# EAGLE design Nixieclock (EAGLE 7.2.0)
CNAME: http://niekproductions.com/; CREVISION: 1.0; DESIGNER: Niek Blankers

## Sheet 1 of 2
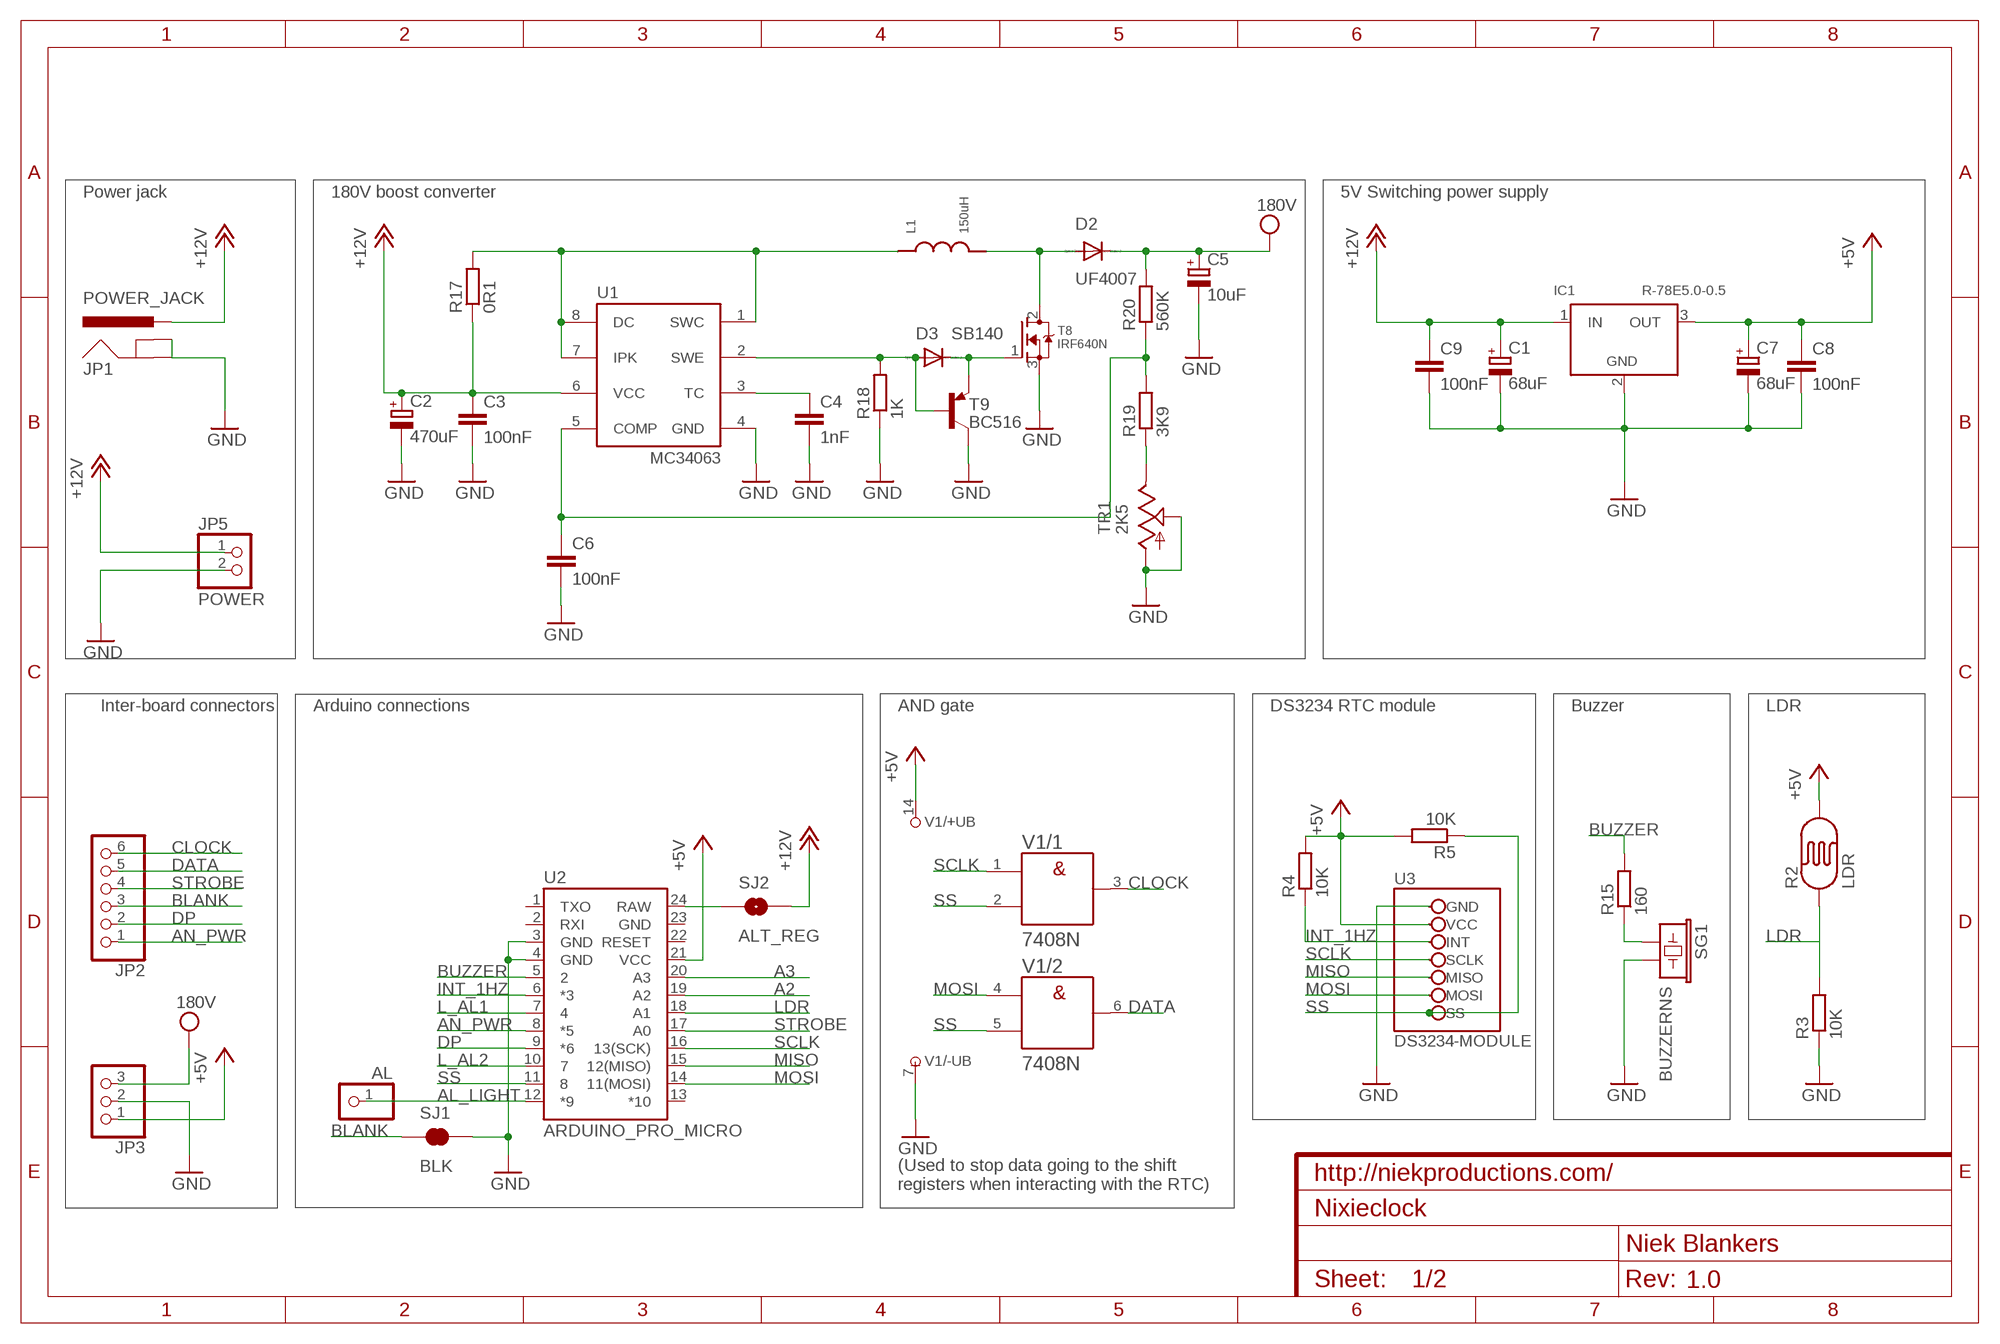
[diagram p0: schematic, sheet 1]

### Parts
AL  PINHD-1X1  [1X01]
C1  68uF  CPOL-EUE2.5-6  [E2,5-6]
C2  470uF  CPOL-EUE5-10.5  [E5-10,5]
C3  100nF  C-EU025-024X044  [C025-024X044]
C4  1nF  C-EU025-024X044  [C025-024X044]
C5  10uF  CPOL-EUE5-10.5  [E5-10,5]
C6  100nF  C-EU025-024X044  [C025-024X044]
C7  68uF  CPOL-EUE2.5-6  [E2,5-6]
C8  100nF  C-EU025-025X050  [C025-025X050]
C9  100nF  C-EU025-025X050  [C025-025X050]
D2  UF4007  1N4933  [DO41-10]
D3  SB140  1N4004  [DO41-10]
IC1  R-78E5.0-0.5  [R-78E]
JP1  POWER_JACK  POWER_JACKPTH_LOCK  [POWER_JACK_PTH_LOCK]
JP2  PINHD-1X6  [1X06]
JP3  PINHD-1X3  [1X03]
JP5  POWER  PINHD-1X2  [1X02]
L1  150uH  INDUCTOR  [INDUCTOR]
R2  LDR  PHOTOCELLPTH  [PHOTOCELL]
R3  10K  R-EU_0204/7  [0204/7]
R4  10K  R-EU_0204/7  [0204/7]
R5  10K  R-EU_0204/7  [0204/7]
R15  160  R-EU_0204/7  [0204/7]
R17  0R1  R-EU_0309/12  [0309/12]
R18  1K  R-EU_0207/10  [0207/10]
R19  3K9  R-EU_0207/10  [0207/10]
R20  560K  R-EU_0207/10  [0207/10]
SG1  BUZZERNS  [BUZZER-12MM-NS]
SJ1  BLK  JUMPER-PAD-2-NC_BY_TRACE  [PAD-JUMPER-2-NC_BY_TRACE_YES_SILK]
SJ2  ALT_REG  SOLDERJUMPERNO  [SJ_2S-NO]
T8  IRF640N  MOSFET-NGDS_TO220V  [TO220V]
T9  BC516  [TO92-EBC]
TR1  2K5  TRIM  [6MM]
U1  MC34063  MC33063/MC34063P  [DIL08]
U2  ARDUINO_PRO_MICRO  [ARDUINO_PRO_MICRO]
U3  DS3234-MODULE  [GEETECH-DS3234]
V1  7408N  [DIL14]

### Nets
+5V: C7.+ C8.1 IC1.3(OUT) JP3.1 R2.2 R4.2 R5.2 U2.21(VCC) U3.VCC V1.14(/+UB:+UB) ; also sheet 2
+12V: C1.+ C2.+ C3.1 C9.1 IC1.1(IN) JP1.PWR JP5.1 R17.1 SJ2.2 U1.6(VCC)
A2: U2.19(A2) ; also sheet 2
A3: U2.20(A3) ; also sheet 2
AL_LIGHT: AL.1 U2.12(*9)
AN_PWR: JP2.1 U2.8(*5) ; also sheet 2
BLANK: JP2.3 SJ1.1
BUZZER: R15.2 U2.5
CLOCK: JP2.6 V1.3(/1:Y)
DATA: JP2.5 V1.6(/2:Y)
DP: JP2.2 U2.9(*6)
GND: C1.- C2.- C3.2 C4.2 C5.- C6.2 C7.- C8.2 C9.2 IC1.2(GND) JP1.GND JP1.GNDBREAK JP3.2 JP5.2 R3.1 R18.1 SG1.- SG1.-- SJ1.2 T8.3(S) T9.C TR1.A TR1.S U1.4(GND) U2.3(GND) U2.4(GND) U3.GND~1(GND) U3.GND~2(GND) V1.7(/-UB:-UB) ; also sheet 2
INT_1HZ: R4.1 U2.6(*3) U3.INT
L_AL1: U2.7 ; also sheet 2
L_AL2: U2.10 ; also sheet 2
LDR: R2.1 R3.2 U2.18(A1)
MISO: U2.15(12(MISO)) U3.MISO
MOSI: U2.14(11(MOSI)) U3.MOSI V1.4(/2:A)
N$5: D3.A R18.2 T9.B U1.2(SWE)
N$6: D3.C T8.1(G) T9.E
N$7: C4.1 U1.3(TC)
N$8: L1.P$1 R17.2 U1.1(SWC) U1.7(IPK) U1.8(DC)
N$9: D2.A L1.P$2 T8.2(D)
N$10: C6.1 R19.2 R20.1 U1.5(COMP)
N$11: R19.1 TR1.E
N$14: SJ2.1 U2.24(RAW)
N$21: R15.1 SG1.+
SCLK: U2.16(13(SCK)) U3.SCLK V1.1(/1:A)
SS: R5.1 U2.11 U3.SS V1.2(/1:B) V1.5(/2:B)
STROBE: JP2.4 U2.17(A0)
VPP: C5.+ D2.C JP3.3 R20.2 ; supply symbol labelled 180V ; also sheet 2
Unconnected: U2.1(TXO) U2.2(RXI) U2.13(*10) U2.22(RESET) U2.23(GND)

### Notes on the sheet
- Power jack | 180V boost converter | 5V Switching power supply
- Inter-board connectors | Arduino connections | AND gate | DS3234 RTC module | Buzzer | LDR
- (Used to stop data going to the shift 
  registers when interacting with the RTC)

## Sheet 2 of 2
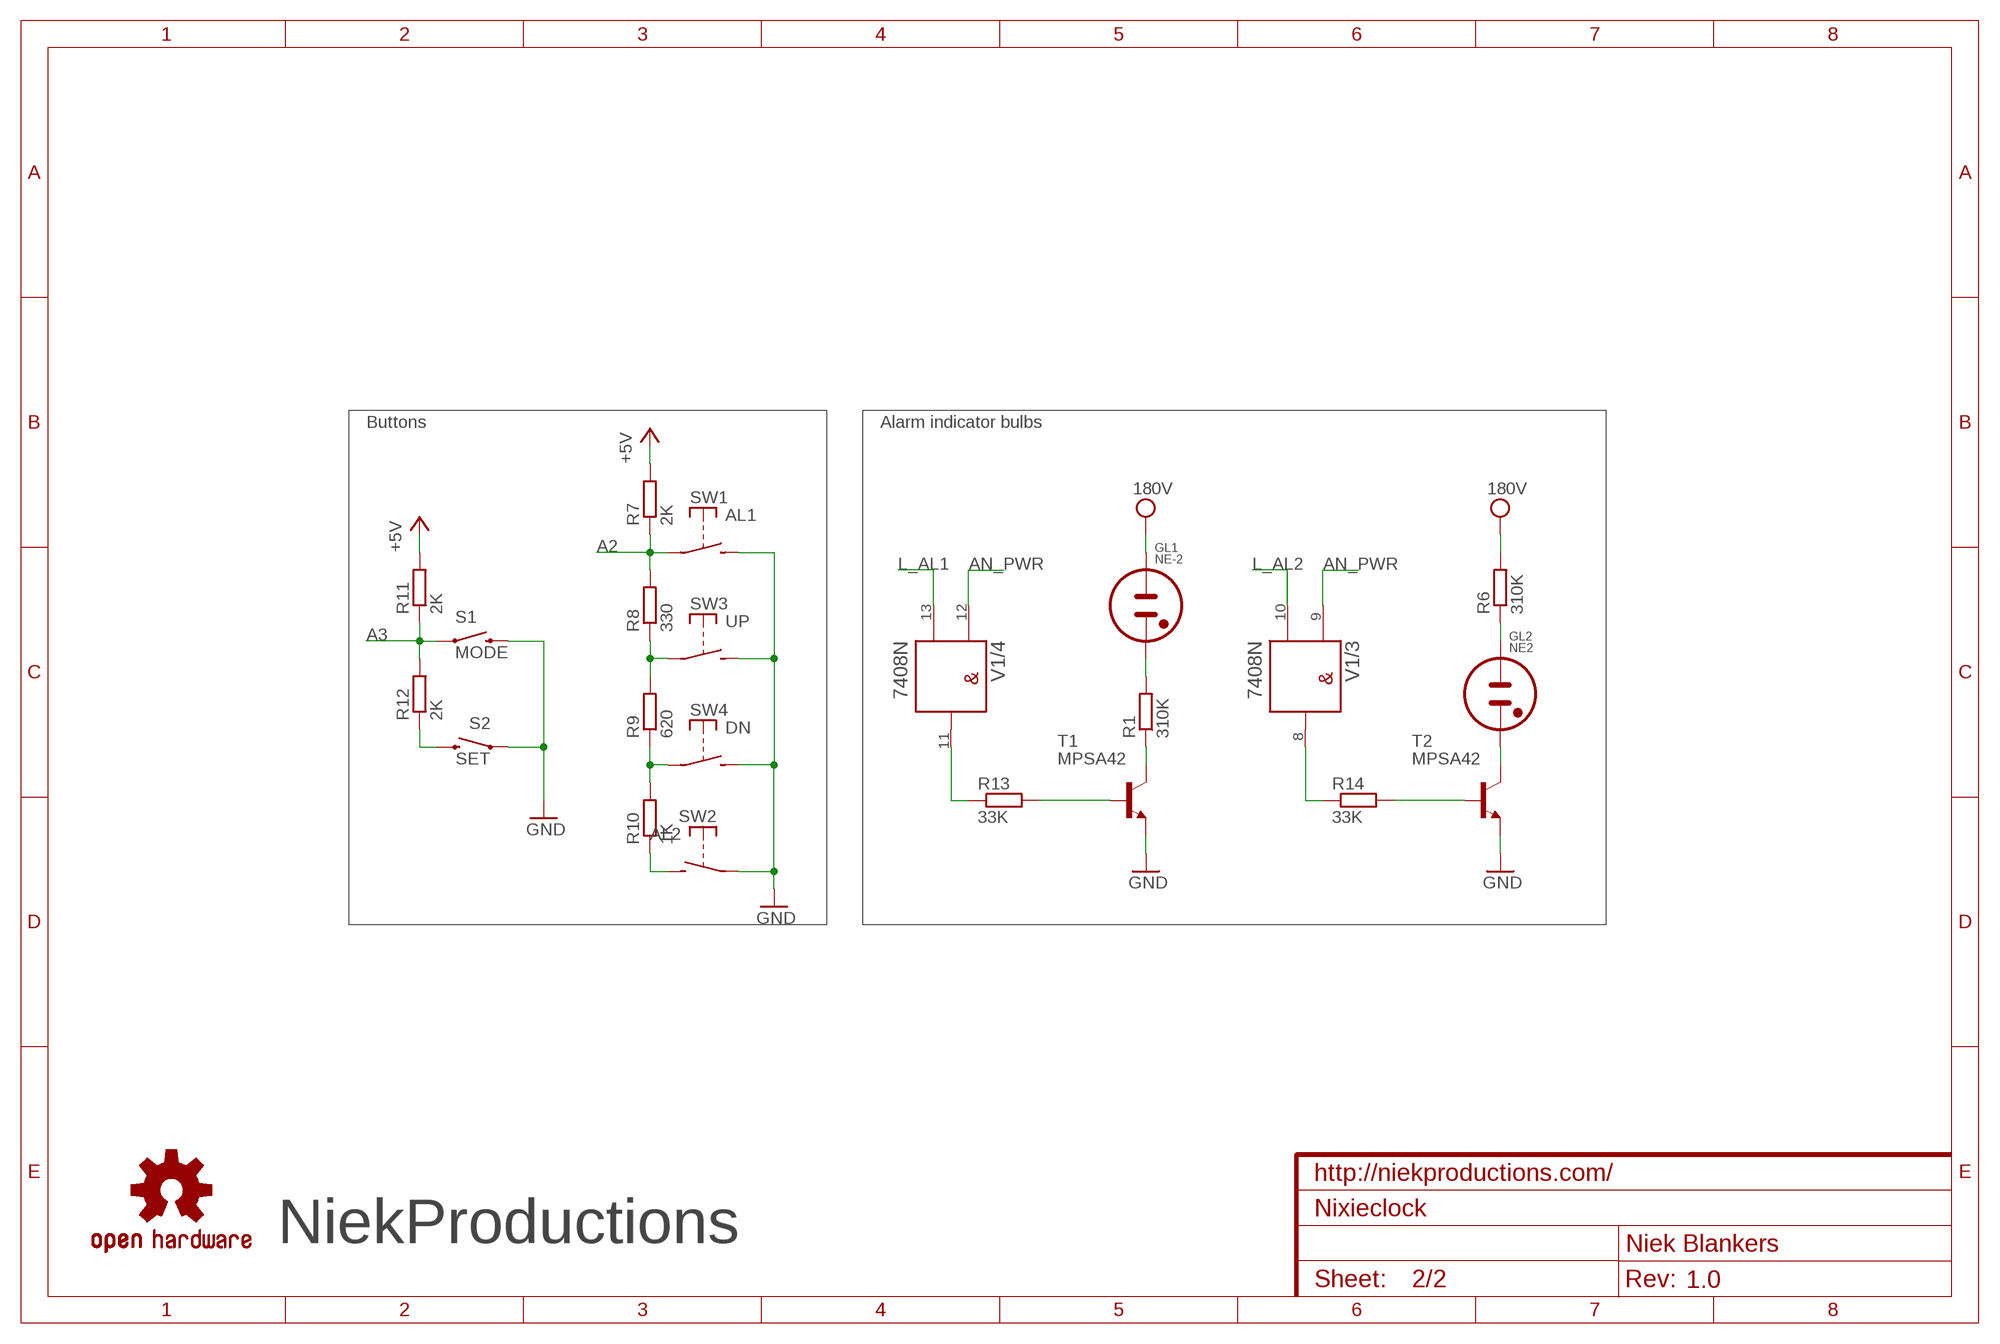
[diagram p1: schematic, sheet 2]

### Parts
GL1  NE-2  NE2-NEON-BULB-DRILL  [NE2-NEON-BULB-DRILL]
GL2  NE2  NE2-NEON-BULB-DRILL  [NE2-NEON-BULB-DRILL]
LOGO2  OSHW-LOGOL  [OSHW-LOGO-L]
R1  310K  R-EU_0204/2V  [0204V]
R6  310K  R-EU_0204/7  [0204/7]
R7  2K  R-EU_0204/7  [0204/7]
R8  330  R-EU_0204/2V  [0204V]
R9  620  R-EU_0204/2V  [0204V]
R10  1K  R-EU_0204/2V  [0204V]
R11  2K  R-EU_0204/7  [0204/7]
R12  2K  R-EU_0204/7  [0204/7]
R13  33K  R-EU_0204/7  [0204/7]
R14  33K  R-EU_0204/7  [0204/7]
S1  MODE  SWITCH-MOMENTARY-2SIDE_EZ  [TACTILE-PTH-SIDEEZ]
S2  SET  SWITCH-MOMENTARY-2SIDE_EZ  [TACTILE-PTH-SIDEEZ]
SW1  AL1  TACTILE-SQ12.65MM-WHITE  [SW-12.65MM-SQ-WHITE]
SW2  AL2  TACTILE-SQ12.65MM-WHITE  [SW-12.65MM-SQ-WHITE]
SW3  UP  TACTILE-SQ12.65MM-WHITE  [SW-12.65MM-SQ-WHITE]
SW4  DN  TACTILE-SQ12.65MM-WHITE  [SW-12.65MM-SQ-WHITE]
T1  MPSA42  MPSA42-NPN-TO92-EBC  [TO92-EBC]
T2  MPSA42  MPSA42-NPN-TO92-EBC  [TO92-EBC]
U$4  NPLOGO1CM-DIA  [NPLOGO-1CM]

### Nets
+5V: R7.2 R11.2 ; also sheet 1
A2: R7.1 R8.2 SW1.SW-CENTER(P) ; also sheet 1
A3: R11.1 R12.2 S1.1 ; also sheet 1
AN_PWR: V1.9(/3:A) V1.12(/4:A) ; also sheet 1
GND: S1.2 S2.1 SW1.SW-OUTSIDE(S) SW2.SW-CENTER(P) SW3.SW-OUTSIDE(S) SW4.SW-OUTSIDE(S) T1.E T2.E ; also sheet 1
L_AL1: V1.13(/4:B) ; also sheet 1
L_AL2: V1.10(/3:B) ; also sheet 1
N$1: R13.2 T1.B
N$2: R14.2 T2.B
N$3: R12.1 S2.2
N$4: R9.1 R10.2 SW4.SW-CENTER(P)
N$12: R8.1 R9.2 SW3.SW-CENTER(P)
N$13: R10.1 SW2.SW-OUTSIDE(S)
N$15: R1.1 T1.C
N$16: GL2.2(A1) T2.C
N$17: GL1.2(A1) R1.2
N$18: GL2.1(A) R6.1
N$19: R13.1 V1.11(/4:Y)
N$20: R14.1 V1.8(/3:Y)
VPP: GL1.1(A) R6.2 ; supply symbol labelled 180V ; also sheet 1

### Notes on the sheet
- Buttons | Alarm indicator bulbs

## Library data of the parts
AL = pinhead:PINHD-1X1: PIN HEADER
C1 C2 C5 C7 = resistor:CPOL-EU: POLARIZED CAPACITOR, European symbol
C3 C4 C6 C8 C9 = resistor:C-EU: CAPACITOR, European symbol
D2 = diode:1N4933: DIODE fast recovery rectifier, 1A
D3 = diode:1N4004: DIODE general purpose rectifier, 1 A
GL1 GL2 = nixie_tube:NE2-NEON-BULB: Neon indicator (wire connection)
IC1 = recom-international:R-78E5.0-0.5: Switching DC/DC Converter Drop-in replacement for 7805
JP1 = SparkFun-Connectors:POWER_JACK: Power Jack This is the standard 5.5mm barrel jack for power. The PTH is the most common, proven, reliable, footprint. The Slot footprint only works if the mill layer is transmitted to the PCB fab house so be warned. Mating wall wart : TOL-00298 (and others); PROD_ID: CONN-08197; SF_ID: PRT-00119
JP2 = pinhead:PINHD-1X6: PIN HEADER
JP3 = pinhead:PINHD-1X3: PIN HEADER
JP5 = pinhead:PINHD-1X2: PIN HEADER
L1 = NixieClock:INDUCTOR
LOGO2 = SparkFun-Aesthetics:OSHW-LOGO: Open Source Hardware Logo This logo indicates the piece of hardware it is found on incorporates a OSHW license and/or adheres to the definition of open source hardware found here: http://freedomdefined.org/OSHW
R1 R3-R15 R17-R20 = resistor:R-EU_: RESISTOR, European symbol
R2 = SparkFun-Sensors:PHOTOCELL: CdS photoresistor. This is a low cost way to detect light levels. Resistance decreases with more incoming light. SparkFun SKU: SEN-09088
S1 S2 = SparkFun-Electromechanical:SWITCH-MOMENTARY-2: Various NO switches- pushbuttons, reed, etc
SG1 = SparkFun-Electromechanical:BUZZER: Buzzer 12mm Spark Fun Electronics SKU : Comp-Buzzer
SJ1 = SparkFun-Passives:JUMPER-PAD-2-NC_BY_TRACE
SJ2 = SparkFun-Retired:SOLDERJUMPER: Solder Jumper Standard SMD solder jumper. Used to automate production. Two varients : Normally Open and Normally Closed are the same, but have different paste layers. NC will have a large amount of paste and should jumper during reflow.
SW1-SW4 = switch-misc:TACTILE-SQ: Two square tact switches
T1 T2 = transistor:*-NPN-: NPN Transistror BF959 corrected 2008.03.06
T8 = adafruit:MOSFET-N: N-Channel Mosfet 2N7002E - 60V 260mA SOT23 [Digikey: 2N7002ET1GOSTR-ND] - REEL BSH103 - 30V 850mA SOT23 [Digikey: 568-5013-1-ND]
T9 = transistor-pnp:BC516*: PNP Transistror
TR1 = adafruit:TRIM
U1 = adafruit:MC33063/MC34063: MC33063 and MC34063 Basic DC/DC converter with internal power-NPN transistor, 100KHz, 1.5A peak switch current. 3-40 input/output.
U2 = SparkFun-Boards:ARDUINO_PRO_MICRO
U3 = RTC:DS3234-MODULE: Geeetech DS3234 module Position: flat on board, battery up.
U$4 = NPlogo:NPLOGO
V1 = 74ttl-din:74*08: Quad 2-input AND gate

## Board
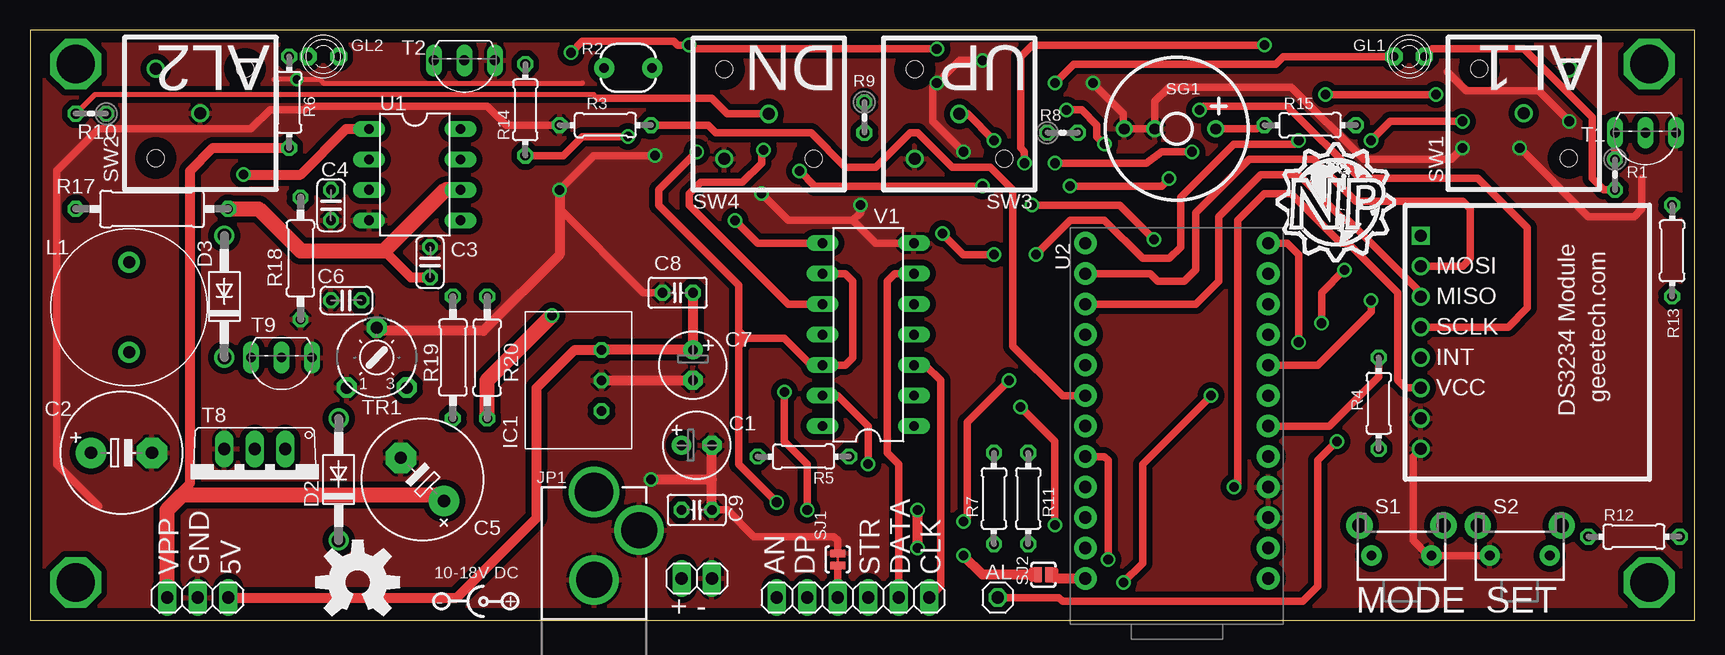
[diagram p2: board, top side]
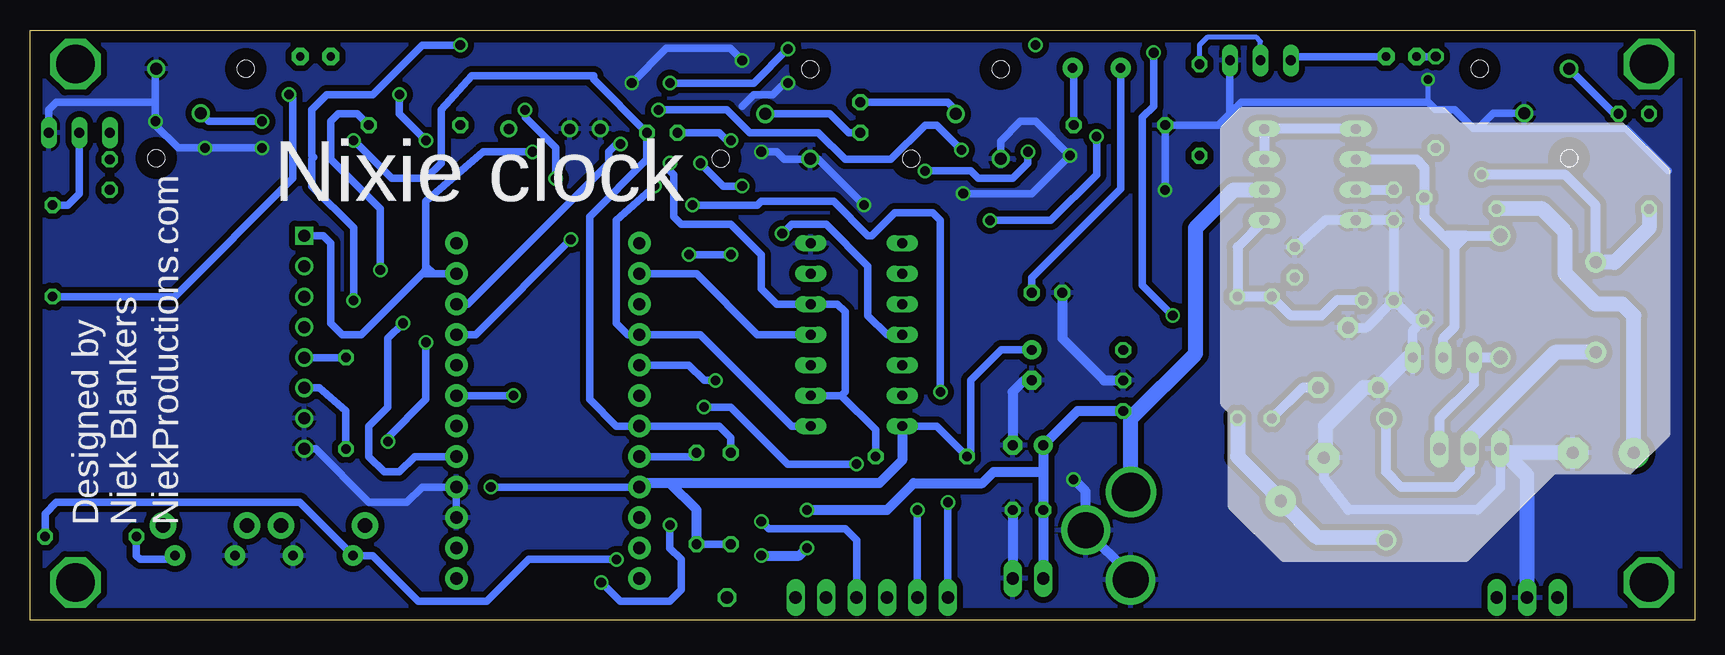
[diagram p3: board, bottom side, seen from below]

Size 138.73 x 49.2 mm. Coordinates in mm from the lower left corner, seen from the top.
Outline: 0,0 138.73,0 138.73,49.2 0,49.2 0,0
Copper layers (1*16): Top 0.035mm / dielectric 1.53mm / Bottom 0.035mm
Design rules "safe": minimum track width 16mil, minimum drill 24mil, track to track 0.5mm, track to pad 0.5mm, pad to pad 8mil, via to via 8mil, smd to smd 8mil, copper to edge 40mil, drill to drill 8mil, minimum pad ring 10mil, minimum via ring 8mil, stop-mask expansion 4mil, vias tented up to drill 32mil, thermal gap 10mil

### Footprints (pad centres in the part's own frame; a part is rotated, then mirrored left to right if it is on the bottom)
1X01 = drill 1.016 octagon: 1 0,0
E2,5-6 = drill 0.813 pad 1.6: + -1.27,0 | drill 0.813 pad 1.6 octagon: - 1.27,0
E5-10,5 = drill 1.016 pad 2.54: + -2.54,0 | drill 1.016 pad 2.54 octagon: - 2.54,0
C025-024X044 = drill 0.813 octagon: 1 -1.27,0; 2 1.27,0
C025-025X050 = drill 0.813 octagon: 1 -1.27,0; 2 1.27,0
DO41-10 = drill 1.118: A 5.08,0; C -5.08,0
NE2-NEON-BULB-DRILL = drill 0.7 pad 1.422 octagon: 1 0,1.27; 2 0,-1.27
R-78E = drill 0.8 octagon: 1 3.175,4.445; 2 5.715,4.445; 3 8.255,4.445
POWER_JACK_PTH_LOCK = drill 2.997 pad 4.115: GND 0.025,6.557; GNDBREAK 3.762,10.7 | drill 3.2 pad 4.115: PWR 0,13.878
1X06 = drill 1.016 long: 1 -6.35,0; 2 -3.81,0; 3 -1.27,0; 4 1.27,0; 5 3.81,0; 6 6.35,0
1X03 = drill 1.016 long: 1 -2.54,0; 2 0,0; 3 2.54,0
1X02 = drill 1.016 long: 1 -1.27,0; 2 1.27,0
INDUCTOR = drill 1 pad 1.778: P$1 0,0; P$2 7.5,0
0204V = drill 0.813 octagon: 1 -1.27,0; 2 1.27,0
PHOTOCELL = drill 0.8 pad 1.676: 1 -2,0; 2 2,0
0204/7 = drill 0.813 octagon: 1 -3.81,0; 2 3.81,0
0309/12 = drill 0.813 octagon: 1 -6.35,0; 2 6.35,0
0207/10 = drill 0.813 octagon: 1 -5.08,0; 2 5.08,0
TACTILE-PTH-SIDEEZ = drill 0.8 pad 1.7: 1 -2.5,0; 2 2.5,0 | drill 1.2 pad 2.2: ANCHOR1 -3.5,2.5; ANCHOR2 3.5,2.5
BUZZER-12MM-NS = drill 0.9: + 3.25,0; - -1.83,0; -- -4.37,0
PAD-JUMPER-2-NC_BY_TRACE_YES_SILK = smd 0.635 x 1.27: 1 -0.508,0; 2 0.508,0
SJ_2S-NO = smd 0.635 x 1.27: 1 -0.45,0; 2 0.45,0
SW-12.65MM-SQ-WHITE = drill 1: SW-CENTER 6.325,6.325; SW-OUTSIDE 2.6,2.6 | hole 1.4: 2.6,10.05; 10.05,2.6
TO92-EBC = drill 0.813 long: B 0,-1.27; C 2.54,-1.27; E -2.54,-1.27
TO220V = drill 1.016 long: 1 -2.54,-2.54; 2 0,-2.54; 3 2.54,-2.54
TO92-EBC' = drill 0.813 long: B 0,-1.27; C -2.54,-1.27; E 2.54,-1.27
6MM = drill 1 pad 1.676 octagon: A -2.5,-2.5; E 2.5,-2.5; S 0,2.5
DIL08 = drill 0.813 long: 1 -3.81,-3.81; 2 -1.27,-3.81; 3 1.27,-3.81; 4 3.81,-3.81; 5 3.81,3.81; 6 1.27,3.81; 7 -1.27,3.81; 8 -3.81,3.81
ARDUINO_PRO_MICRO = drill 1.016 pad 1.88: 1 -7.62,12.7; 2 -7.62,10.16; 3 -7.62,7.62; 4 -7.62,5.08; 5 -7.62,2.54; 6 -7.62,0; 7 -7.62,-2.54; 8 -7.62,-5.08; 9 -7.62,-7.62; 10 -7.62,-10.16; 11 -7.62,-12.7; 12 -7.62,-15.24; 13 7.62,-15.24; 14 7.62,-12.7; 15 7.62,-10.16; 16 7.62,-7.62; 17 7.62,-5.08; 18 7.62,-2.54; 19 7.62,0; 20 7.62,2.54; 21 7.62,5.08; 22 7.62,7.62; 23 7.62,10.16; 24 7.62,12.7
GEETECH-DS3234 = drill 1: GND~1 17.78,1.27; GND~2 20.32,1.27; INT 12.7,1.27; MISO 7.62,1.27; MOSI 5.08,1.27; SCLK 10.16,1.27; VCC 15.24,1.27 | drill 1 square: SS 2.54,1.27
DIL14 = drill 0.813 long: 1 -7.62,-3.81; 2 -5.08,-3.81; 3 -2.54,-3.81; 4 0,-3.81; 5 2.54,-3.81; 6 5.08,-3.81; 7 7.62,-3.81; 8 7.62,3.81; 9 5.08,3.81; 10 2.54,3.81; 11 0,3.81; 12 -2.54,3.81; 13 -5.08,3.81; 14 -7.62,3.81

### Placement (x,y rotation side)
AL  80.64,1.91 0 top
C1  55.56,14.61 0 top
C2  7.62,13.97 0 top
C3  33.34,29.84 90 top
C4  25.08,34.61 270 top
C5  32.7,11.75 135 top
C6  26.35,26.67 180 top
C7  55.24,21.27 270 top
C8  53.98,27.3 180 top
C9  55.56,9.21 0 top
D2  25.72,11.75 90 top
D3  16.19,26.99 90 top
GL1  114.94,46.99 90 top
GL2  24.45,46.99 90 top
IC1  52.07,14.29 90 top
JP1  46.99,-3.17 0 top
JP2  68.58,1.91 0 top
JP3  13.97,1.91 180 top
JP5  55.56,3.49 0 top
L1  8.26,29.84 270 top
LOGO2  27.3,3.17 0 top
R1  132.08,37.15 270 top
R2  49.85,46.04 180 top
R3  47.94,41.27 0 top
R4  112.39,18.1 270 top
R5  64.45,13.65 180 top
R6  21.59,43.18 270 top
R7  80.33,10.16 270 top
R8  86.04,40.64 0 top
R9  69.53,41.91 270 top
R10  5.08,42.23 180 top
R11  83.19,10.16 270 top
R12  133.67,6.99 0 top
R13  136.84,30.8 90 top
R14  41.27,42.55 90 top
R15  106.68,41.27 0 top
R17  10.16,34.29 180 top
R18  22.54,30.16 90 top
R19  35.24,21.91 90 top
R20  38.1,21.91 270 top
S1  114.3,5.4 0 top
S2  124.14,5.4 0 top
SG1  95.57,40.96 0 top
SJ1  67.31,5.08 90 top
SJ2  84.45,3.81 180 top
SW1  130.81,48.58 180 top
SW2  7.87,48.58 270 top
SW3  71.12,35.88 0 top
SW4  55.24,35.88 0 top
T1  134.62,39.37 180 top
T2  36.2,45.4 180 top
T8  18.73,11.75 180 top
T9  BC516  [TO92-EBC']  20.95,20.64 180 top
TR1  28.89,21.91 0 top
U1  MC33063  [DIL08]  32.07,37.15 270 top
U2  95.57,16.19 180 top
U3  114.62,34.61 270 top
U$4  103.82,29.84 0 top
V1  69.85,23.81 90 top

### Tracks (layer width: path | path; a pad name or v marks a point on that pad's centre or on a via)
+5V  (via drill 0.8)
  Top 0.406: 100.65,11.43 v100.33,11.11
  Top 0.61: 100.65,11.43 100.65,33.34 102.87,35.56 105.09,35.56 109.22,31.43 109.86,31.43 113.98,27.3 113.98,20 114.62,19.37 U3.VCC
  Top 0.813: JP3.1 35.56,1.91 42.23,8.57 42.23,19.37 45.4,22.54 IC1.3 C7.+ C8.1
  Bottom 0.61: R2.2 47.85,35.97 55.24,28.57 C8.1 | C7.+ 57.78,22.54 60.33,20 60.33,13.97 R5.2 63.18,16.19 V1.14 | v100.33,11.11 U2.21 | R7.2 R11.2 | R4.2 112.39,17.46 114.62,19.37 U3.VCC
  Bottom 0.813: 87.63,10.79 U2.21 87.63,11.43 85.41,11.43 | 85.41,11.43 67.94,11.43 66.04,13.34 V1.14 | R11.2 83.19,9.21 85.41,11.43
+12V  (via drill 0.8)
  Top 0.61: SJ2.2 83.82,3.81 83.5,4.13 83.5,3.81 83.5,3.49
  Top 0.813: 83.5,3.81 79.38,3.81 v77.79,5.4 | v73.98,6.03 v73.98,9.21 | C3.1 31.75,28.57 29.53,30.8
  Top 1.27: R17.1 19.05,34.29 22.54,30.8 29.53,30.8 34.61,35.88 U1.6
  Bottom 0.813: 46.99,16.83 IC1.1 51.44,17.46 C1.+ 54.29,12.38 | 54.29,12.38 C9.1 JP5.1 | v77.79,5.4 74.61,5.4 v73.98,6.03 | v73.98,9.21 67.31,9.21 65.09,11.43 59.37,11.43 58.42,12.38 54.29,12.38
  Bottom 1.27: U1.6 38.42,35.88 41.59,32.7 41.59,22.23 46.99,16.83 JP1.PWR | C2.+ 5.08,25.4 6.03,26.35 8.26,26.35 10.79,28.89 10.79,32.38 12.7,34.29 R17.1
A2  (via drill 0.8)
  Top 0.61: v119.38,41.59 113.35,41.59 v111.76,40.01
  Bottom 0.61: R7.1 80.33,15.24 81.28,16.19 U2.19 89.85,16.19 92.08,18.41 92.08,33.66 87.31,38.42 R8.2 91.76,45.09 91.76,45.4 101.92,45.4 104.46,42.55 104.46,38.1 105.73,36.83 108.58,36.83 v111.76,40.01 | v119.38,41.59 123.83,41.59 SW1.SW-CENTER
A3  (via drill 0.8)
  Top 0.61: v89.85,5.08 89.85,13.34 89.53,13.65 U2.20
  Bottom 0.61: U2.20 83.5,13.65 R11.1 | v89.85,5.08 97.16,5.08 100.65,1.59 106.36,1.59 110.17,5.4 S1.1 116.25,9.84 136.53,9.84 137.48,8.89 R12.2
AL_LIGHT  (via drill 0.8)
  Top 0.61: AL.1 85.72,1.91 86.04,1.59 106.05,1.59 107.31,2.86 107.31,13.34 v108.9,14.92 | U2.12 104.78,31.43 105.73,30.48 v105.73,23.18
  Bottom 0.61: v108.9,14.92 108.9,15.24 105.73,18.41 v105.73,23.18
AN_PWR  (via drill 0.8)
  Top 0.61: v62.23,9.84 59.05,13.02 59.05,22.86 | v111.76,26.67 111.76,25.72 107.31,21.27 U2.8 | v55.56,39.05 52.39,35.88 52.39,34.61 59.05,27.94 59.05,24.13 | 59.05,23.5 59.05,22.86 | V1.9 67.94,28.89 68.58,28.26 68.58,21.91 67.94,21.27 V1.12 65.09,21.27 62.87,23.5 59.69,23.5 | 59.69,23.5 59.05,23.5 | v79.38,36.2 65.41,36.2 v64.14,37.47 | 59.69,23.5 59.05,24.13 | 59.05,24.13 59.05,23.5 | 59.05,22.86 59.69,23.5 | v102.87,47.94 83.5,47.94 82.55,46.99 82.55,39.37 82.87,39.05 v82.87,38.1
  Bottom 0.61: JP2.1 v62.23,9.84 | v111.76,26.67 111.76,32.7 115.25,36.2 115.25,38.42 115.09,38.58 115.25,38.73 115.25,42.55 113.98,43.81 110.17,43.81 106.05,47.94 v102.87,47.94 | v55.56,39.05 55.56,38.1 56.83,36.83 59.69,36.83 60.33,37.47 v64.14,37.47 | v79.38,36.2 80.96,36.2 v82.87,38.1
BLANK
  Top 0.61: JP2.3 SJ1.1
BUZZER  (via drill 0.8)
  Top 0.61: v107.63,24.77 107.63,27.3 v109.54,29.21
  Bottom 0.61: U2.5 106.68,13.65 107.95,12.38 109.22,12.38 110.49,13.65 110.49,16.19 108.9,17.78 108.9,23.5 v107.63,24.77 | v109.54,29.21 109.54,34.29 113.67,38.42 113.67,41.59 113.03,42.23 111.44,42.23 R15.2
CLOCK
  Top 0.61: V1.3 74.61,21.27 75.88,20 75.88,2.86 JP2.6
DATA
  Top 0.61: V1.6 72.07,28.89 71.44,28.26 71.44,13.97 72.39,13.02 JP2.5
DP  (via drill 0.8)
  Top 0.61: v64.77,9.21 64.77,13.02 62.87,14.92 v62.87,19.05 | v93.66,31.75 90.81,34.61 v83.5,34.61
  Bottom 0.61: U2.9 101.6,23.81 v93.66,31.75 | v64.77,9.21 JP2.2 | v62.87,19.05 62.87,33.34 63.5,33.97 66.67,33.97 68.58,32.07 68.9,32.07 71.75,34.92 77.79,34.92 78.11,34.61 v83.5,34.61
GND  (via drill 0.7, 0.8)
  Top 0.406: 20.32,45.09 v22.23,45.09 24.13,45.09 24.45,44.77 46.04,44.77
  Top 0.61: SJ1.2 67.31,6.67 66.99,6.99 60.33,6.99 58.1,9.21 C9.2 | R3.1 39.69,41.27 38.1,42.86 23.18,42.86 22.86,42.55 20,42.55 18.41,40.96 5.71,40.96 2.22,37.47 2.22,13.02 5.71,9.53 | V1.7 70.48,31.43 68.58,33.34 | 68.58,33.34 63.18,33.34 v60.96,35.56 | v52.07,38.73 46.99,38.73 v44.13,35.88 44.13,34.29 51.12,27.3 C8.2 | v119.38,39.37 118.43,38.42 111.12,38.42 105.09,44.45 94.93,44.45 93.74,43.26 SG1.- SG1.-- 91.12,41.03 91.12,42.23 v88.58,44.77 | S2.1 S1.2 116.52,5.4 115.25,6.67 115.25,13.65 U3.GND~2 | 134.3,36.83 134.3,34.29 133.67,33.66 129.86,33.66 v124.14,39.37 | v128.27,41.59 125.73,44.13 119.7,44.13 118.11,45.72 | v69.22,34.61 69.22,33.97 68.58,33.34 | v79.38,46.67 77.47,46.67 v75.56,44.77 75.25,44.45 75.25,41.59 v77.79,39.05
  Top 0.813: IC1.2 C7.- | v44.13,35.88 44.13,30.48 37.78,24.13 29.17,24.13 TR1.S | v51.75,11.75 56.83,11.75 C1.- C9.2
  Bottom 0.406: 22.23,43.18 v22.23,45.09
  Bottom 0.61: v44.13,35.88 R3.1 39.69,41.27 38.73,42.23 | 18.1,40.96 18.41,40.96 20,42.55 21.59,42.55 22.23,43.18 37.78,43.18 38.73,42.23 | 18.1,40.96 5.71,40.96 2.22,37.47 | U2.3 U2.4 106.05,11.11 107.31,9.84 110.49,9.84 114.94,14.29 U3.GND~2 | v60.96,35.56 55.24,35.56 v52.07,38.73 54.93,41.59 56.2,41.59 57.84,39.95 SW4.SW-OUTSIDE | T2.E 38.73,42.23 | v88.58,44.77 85.69,47.66 80.37,47.66 v79.38,46.67 | v119.38,39.37 v124.14,39.37 126.36,39.37 128.27,41.27 v128.27,41.59 128.27,43.18 | 128.27,43.18 128.27,45.92 SW1.SW-OUTSIDE | T1.E 137.16,42.55 136.53,43.18 128.27,43.18 | SW2.SW-CENTER 16.8,42.25 18.1,40.96 | v69.22,34.61 73.08,38.48 SW3.SW-OUTSIDE 73.78,38.42 75.88,38.42 76.52,39.05 v77.79,39.05 | v75.56,44.77 75.88,44.77 76.83,43.81 78.42,43.81 79.38,42.86
  Bottom 0.813: C5.- 30.91,13.02 | 30.91,13.02 30.91,11.86 28.89,9.21 18.1,9.21 16.19,11.11 T8.3 | 30.8,13.13 30.91,13.02 | C6.2 C4.2 U1.4 30.8,33.34 C3.2 | TR1.S 27.34,24.41 C6.2 | JP1.GND 47.02,3.79 JP1.GNDBREAK 50.75,10.75 v51.75,11.75 | C8.2 52.7,23.5 49.21,20 IC1.2 | C7.- 55.88,20 56.83,19.05 C1.- | C9.2 JP5.2 | T9.C 23.5,24.13 R18.1 23.5,25.08 C6.2
  Bottom 1.27: 30.8,13.13 30.8,16.19 27.58,19.41 TR1.A 23.89,21.91 T9.C | JP3.2 13.97,12.06 T8.3 15.88,13.97 C2.-
  pour Bottom (isolate 0.305): 0,0 138.75,-0.32 138.75,49.21 0,49.21
  pour Top (isolate 0.305): 0,0 138.75,0 138.75,49.21 0,49.21
INT_1HZ
  Top 0.61: U2.6 108.27,16.19 112.39,20.32 R4.1
  Bottom 0.61: R4.1 U3.INT
L_AL1  (via drill 0.8)
  Top 0.61: v98.42,18.73 92.71,13.02 92.71,4.76 v91.12,3.17 | v85.41,7.94 85.41,14.92 v82.55,17.78 | V1.13 67.31,18.73 69.85,16.19 v69.85,13.02
  Bottom 0.61: v91.12,3.17 89.53,1.59 85.41,1.59 84.45,2.54 84.45,5.08 85.41,6.03 v85.41,7.94 | v69.85,13.02 75.56,13.02 80.33,17.78 v82.55,17.78 | U2.7 v98.42,18.73
L_AL2  (via drill 0.8)
  Top 0.61: V1.10 63.18,26.35 54.93,34.61 54.93,35.56 55.88,36.51 59.37,36.51 60.96,38.1 60.96,39.05 v61.12,39.21 | v86.36,42.55 87.63,42.55 88.9,41.27 88.9,40.32 v89.53,39.69
  Bottom 0.61: U2.10 102.23,26.35 90.49,38.1 90.49,39.05 89.85,39.69 v89.53,39.69 | v86.36,42.55 80.64,42.55 78.74,40.64 73.03,40.64 70.8,38.42 66.99,38.42 64.14,41.27 63.18,41.27 v61.12,39.21
LDR
  Top 0.61: U2.18 86.04,18.73 81.92,22.86 81.92,35.88 80.01,37.78 76.83,37.78 73.98,40.64 73.34,40.64 70.48,37.78 67.94,37.78 65.09,40.64 57.15,40.64 56.52,41.27 R3.2
  Bottom 0.61: R3.2 51.75,45.94 R2.1
MISO
  Top 0.61: U2.15 97.16,26.35 99.06,28.26 99.06,33.66 102.55,37.15 105.73,37.15 109.54,33.34 109.86,33.34 115.57,27.62 115.57,27.3 U3.MISO
MOSI
  Top 0.61: U2.14 93.34,28.89 93.98,28.26 96.2,28.26 97.16,29.21 97.16,33.97 101.6,38.42 107,38.42 110.49,34.92 119.38,34.92 120.02,34.29 120.02,30.16 119.38,29.53 U3.MOSI
  Bottom 0.61: U2.14 83.19,28.89 78.11,23.81 V1.4
N$1
  Bottom 0.61: R13.2 135.57,34.61 134.62,35.56 T1.B
N$2
  Bottom 0.406: T2.B 36.2,48.26 36.51,48.58 40.64,48.58 41.27,47.94 R14.2
N$3
  Bottom 0.61: R12.1 129.86,5.4 129.54,5.08 126.96,5.08 S2.2
N$4
  Top 0.406: 47.31,43.5 46.99,43.81 5.4,43.81 R10.2
  Top 0.61: 47.31,43.5 56.83,43.5 58.1,42.23 61.55,42.23 SW4.SW-CENTER
  Bottom 0.61: SW4.SW-CENTER 61.57,42.52 62.23,43.18 R9.1
N$5
  Bottom 0.813: U1.2 23.18,38.42 22.54,37.78 R18.2 22.54,33.66 20.95,32.07 | 20.95,32.07 20.64,32.07 | 19.05,32.07 D3.A | T9.B 20.95,23.5 20,24.45 20,31.11 | 20.64,31.75 20.95,32.07 | 20,31.11 19.05,32.07 | 19.05,32.07 20.64,32.07 | 20.64,32.07 20.64,31.75 | 20.64,31.75 20,31.11
N$6
  Bottom 0.813: T8.1 21.27,16.83 18.41,19.68 T9.E D3.C
N$7
  Bottom 0.813: U1.3 C4.1
N$8  (via drill 0.8)
  Top 0.813: v17.78,37.15 22.54,37.15 26.35,40.96 U1.1
  Bottom 0.813: U1.1 U1.8 U1.7 | L1.P$1 8.26,34.61 10.79,37.15 v17.78,37.15
  Bottom 1.27: R17.2 3.81,32.7 6.67,29.84 L1.P$1
N$9
  Bottom 0.813: T8.2 18.73,12.38 20,11.11 24.45,11.11 25.72,12.38 D2.A
  Bottom 1.27: L1.P$2 11.63,22.34 18.73,15.24 T8.2
N$10
  Bottom 0.813: U1.5 38.1,31.11 R20.1 R19.2 33.66,25.4 31.11,25.4 29.84,26.67 C6.1
N$11
  Bottom 0.813: TR1.E 32.66,19.41 R19.1
N$12  (via drill 0.8)
  Top 0.61: SW3.SW-CENTER 78.13,42.2 v80.33,40.01
  Bottom 0.61: R9.2 70.48,40.64 72.07,42.23 77.42,42.23 SW3.SW-CENTER | v80.33,40.01 80.64,40.01 81.28,40.64 R8.1
N$13
  Bottom 0.61: R10.1 6.72,42.23 SW2.SW-OUTSIDE
N$14
  Top 0.61: SJ2.1 85.09,3.81 85.41,4.13 85.41,3.49
  Top 0.813: 85.41,3.49 U2.24
N$15
  Top 0.61: R1.1 T1.C
N$16
  Bottom 0.61: GL2.2 33.34,46.99 T2.C
N$17
  Top 0.61: R1.2 131.13,35.88 130.18,36.83 130.18,41.91 124.46,47.62 116.84,47.62 GL1.2
N$18
  Bottom 0.61: GL2.1 R6.1
N$19  (via drill 0.8)
  Top 0.61: v117.16,43.81 v107.95,43.81 | v105.73,40.01 105.41,39.69 100.33,39.69 95.89,35.24 95.89,31.11 94.93,30.16 92.71,30.16 89.53,33.34 86.68,33.34 v83.82,30.48 | v80.33,30.48 77.79,30.48 v76.04,32.23
  Bottom 0.61: V1.11 67.31,23.81 68.9,25.4 68.9,29.53 72.39,33.02 75.25,33.02 v76.04,32.23 | R13.1 126.68,26.99 116.84,36.83 116.84,43.5 v117.16,43.81 | v107.95,43.81 107.95,42.23 v105.73,40.01 | v83.82,30.48 v80.33,30.48
N$20  (via drill 0.8)
  Top 0.61: V1.8 60.64,31.43 v58.74,33.34 | v49.85,40.32 46.04,40.32 44.45,38.73 R14.1
  Bottom 0.61: v58.74,33.34 53.66,33.34 49.85,37.15 v49.85,40.32
N$21
  Top 0.61: SG1.+ 102.23,40.96 R15.1
N$22  (via drill 3.2)
  other vias: 134.94,3.17
N$24  (via drill 3.2)
  other vias: 134.94,46.35
N$25  (via drill 3.2)
  other vias: 3.81,46.35
N$27  (via drill 3.2)
  other vias: 3.81,3.17
SCLK  (via drill 0.8)
  Top 0.61: v86.68,36.2 94.3,36.2 v94.93,36.83 | U3.SCLK 123.19,24.45 124.78,26.04 124.78,32.7 120.65,36.83 110.81,36.83 104.78,42.86 97.79,42.86 v97.47,42.55
  Bottom 0.61: V1.1 75.25,16.19 82.87,23.81 U2.16 88.9,23.81 89.85,24.77 89.85,33.34 v86.68,36.2 | v94.93,36.83 94.93,39.37 97.47,41.91 v97.47,42.55
SS  (via drill 0.8)
  Top 0.61: v85.41,38.1 93.03,38.1 94.3,39.05 v96.84,39.05
  Bottom 0.61: V1.2 71.12,18.73 | 71.12,18.73 70.8,19.05 70.8,25.72 71.44,26.35 V1.5 76.52,26.35 77.79,27.62 77.79,30.48 80.33,33.02 84.45,33.02 85.09,33.66 85.09,37.15 85.41,37.47 v85.41,38.1 | 105.73,29.53 105.73,34.92 100.97,39.05 v96.84,39.05 | 105.73,29.53 105.73,29.21 106.05,28.89 | 106.05,28.89 111.12,23.81 112.71,23.81 113.67,24.77 113.67,31.43 114.3,32.07 U3.SS | R5.1 68.26,15.88 71.12,18.73 | U2.11 105.09,28.89 | 105.09,28.89 105.73,29.53 | 105.09,28.89 106.05,28.89
STROBE  (via drill 0.8)
  Top 0.61: v77.79,8.26 78.11,8.57 78.11,16.51 v81.6,20
  Bottom 0.61: U2.17 83.82,21.27 82.55,20 v81.6,20 | JP2.4 69.85,6.67 70.8,7.62 77.15,7.62 v77.79,8.26
VPP  (via drill 0.8)
  Top 0.61: GL1.1 104.46,46.99 103.82,46.35 87,46.35 v85.41,44.77 | v45.09,47.31 46.04,48.26 53.66,48.26 53.98,47.94 v54.93,47.94 55.24,47.62 v75.56,47.62
  Top 0.813: 33.97,10.48 C5.+ | 12.22,10 12.22,10.32 13.34,11.43 13.34,37.47 15.24,39.37 R6.2
  Top 1.27: JP3.3 11.43,9.21 12.22,10 12.7,10.48 33.97,10.48 | R20.2 38.1,20 v43.5,25.4
  Bottom 0.406: D2.C 25.84,6.85 25.84,6.91
  Bottom 0.61: v85.41,44.77 78.42,44.77 v75.56,47.62 | v45.09,47.31 45.09,42.86 46.04,41.91 46.04,27.94 v43.5,25.4
  Bottom 0.813: 25.73,6.91 25.84,6.91 | C5.+ 34.5,10.05
  Bottom 1.27: 25.84,6.91 31.45,6.91 C5.+ | 34.5,10.05 38.1,13.65 R20.2

### Text on the board
tPlace: AL2 | DN | UP | AL1 | AN | DP | STR | DATA | CLK | 10-18V DC | - | + | MODE | SET | + -
bPlace: Nixie clock | NiekProductions.com | Niek Blankers | Designed by
tNames: VPP | GND | 5V